# Altium schematic sheet KeyInput_MG.SchDoc
size A4
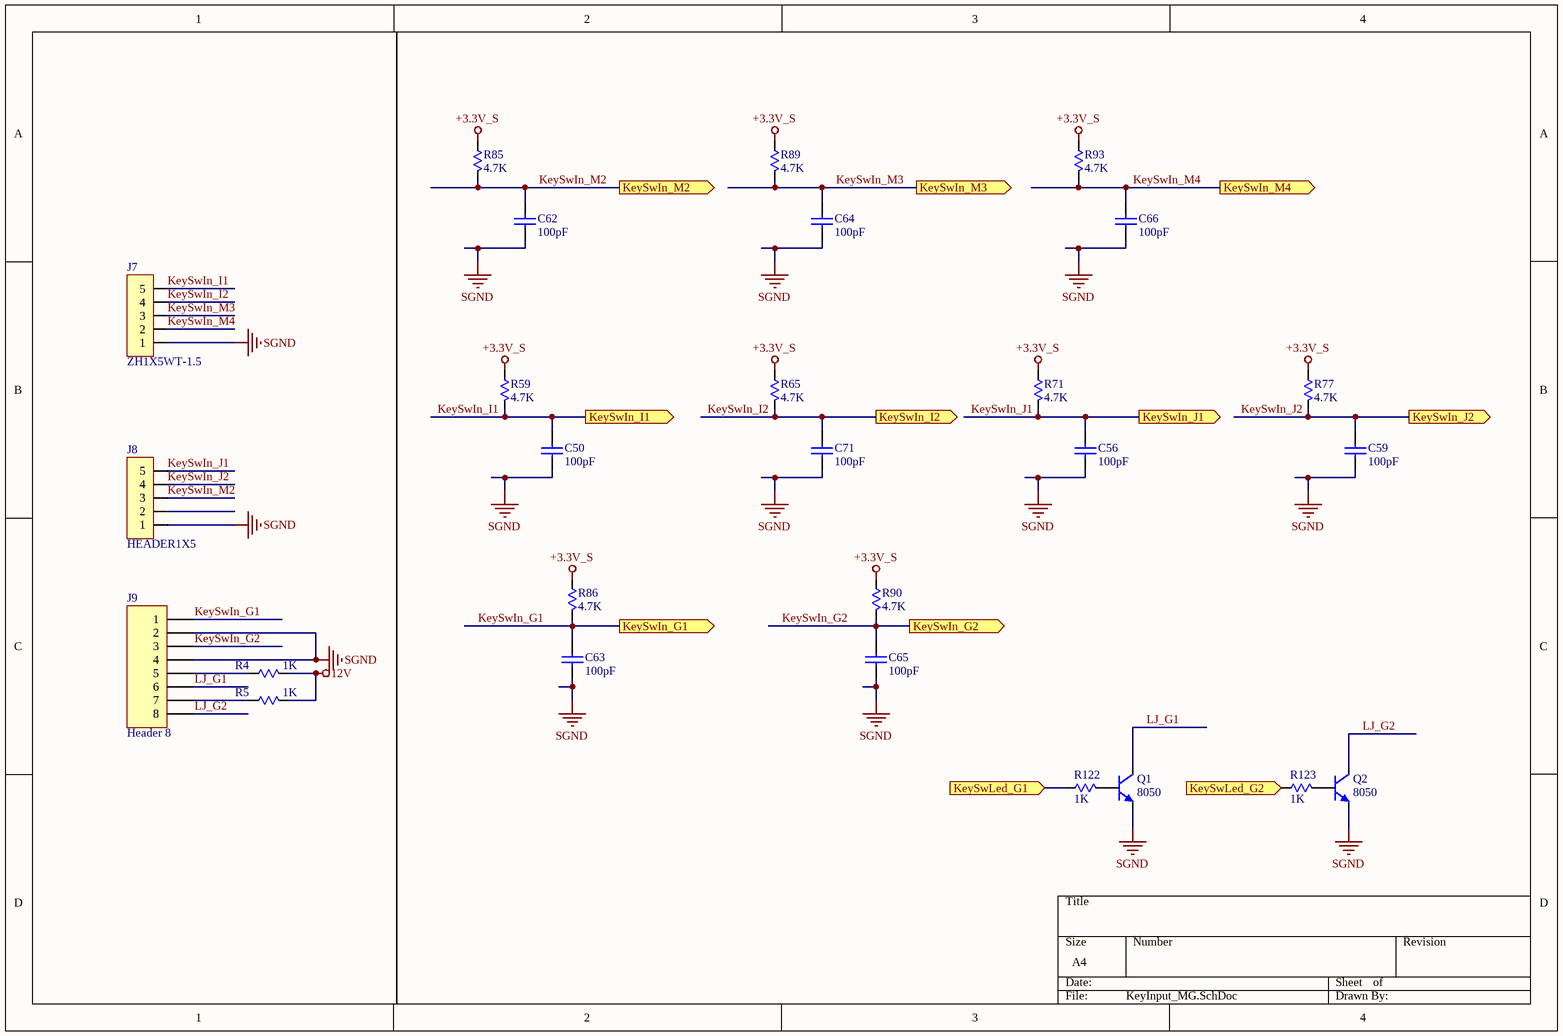
[diagram p0: KeyInput_MG.SchDoc]

## Parts
C50  100pF  [C0805]
C56  100pF  [C0805]
C59  100pF  [C0805]
C62  100pF  [C0805]
C63  100pF  [C0805]
C64  100pF  [C0805]
C65  100pF  [C0805]
C66  100pF  [C0805]
C71  100pF  [C0805]
J7  ZH1X5WT-1.5  [ZH1X5WT-1.5]
J8  HEADER1X5  [ZH1X5WT-1.5]
J9  Header 8  [ZH1X8WT-1.5]
Q1  8050  [SOT-23]
Q2  8050  [SOT-23]
R4  1K  [R0805]
R5  1K  [R0805]
R59  4.7K  [R0805]
R65  4.7K  [R0805]
R71  4.7K  [R0805]
R77  4.7K  [R0805]
R85  4.7K  [R0805]
R86  4.7K  [R0805]
R89  4.7K  [R0805]
R90  4.7K  [R0805]
R93  4.7K  [R0805]
R122  1K  [R0805]
R123  1K  [R0805]

## Ports
KeySwIn_G1 (out), KeySwIn_G2 (out), KeySwIn_I1 (out), KeySwIn_I2 (out), KeySwIn_J1 (out), KeySwIn_J2 (out), KeySwIn_M2 (out), KeySwIn_M3 (out), KeySwIn_M4 (out), KeySwLed_G1 (in), KeySwLed_G2 (in)

## Nets
12V: R4.1 R5.1
+3.3V_S: R59.2 R65.2 R71.2 R77.2 R85.2 R86.2 R89.2 R90.2 R93.2
SGND: C50.2 C56.2 C59.2 C62.2 C63.2 C64.2 C65.2 C66.2 C71.2 J7.1 J8.1 J9.2 J9.4 Q1.2(E) Q2.2(E)
KeySwIn_G1: C63.1 J9.1 R86.1 ; port KeySwIn_G1
KeySwIn_G2: C65.1 J9.3 R90.1 ; port KeySwIn_G2
KeySwIn_I1: C50.1 J7.5 R59.1 ; port KeySwIn_I1
KeySwIn_I2: C71.1 J7.4 R65.1 ; port KeySwIn_I2
KeySwIn_J1: C56.1 J8.5 R71.1 ; port KeySwIn_J1
KeySwIn_J2: C59.1 J8.4 R77.1 ; port KeySwIn_J2
KeySwIn_M2: C62.1 J8.3 R85.1 ; port KeySwIn_M2
KeySwIn_M3: C64.1 J7.3 R89.1 ; port KeySwIn_M3
KeySwIn_M4: C66.1 J7.2 R93.1 ; port KeySwIn_M4
KeySwLed_G1: R122.2 ; port KeySwLed_G1
KeySwLed_G2: R123.2 ; port KeySwLed_G2
LJ_G1: J9.6 Q1.3(C)
LJ_G2: J9.8 Q2.3(C)
NetJ9_5: J9.5 R4.2
NetJ9_7: J9.7 R5.2
NetQ1_1: Q1.1(B) R122.1
NetQ2_1: Q2.1(B) R123.1

Not connected (* = marked no-connect by the designer): J8 2

## Library data of the parts
C50 C56 C59 C62-C66 C71 = Cap: Capacitor; Value: 22pF; Published: 8-Jun-2000; Revision: July-2002: Re-released for DXP Platform.; Publisher: Altium Limited
J7 = HEADER1X5
J9 = Header 8: Header, 8-Pin; LatestRevisionDate: 17-Jul-2002; LatestRevisionNote: Re-released for DXP Platform.; Publisher: Altium Limited
Q1 Q2 = NPN: NPN General Purpose Amplifier; Published: 8-Jun-2000; LatestRevisionDate: 15-Jan-2003; LatestRevisionNote: PCB Footprint 'BCY-W3/D4.7' replaced; DatasheetDocument: 1997; PackageDocument: Sep-1998; PackageReference: TO-92A; Publisher: Altium Limited; Code_JEDEC: TO-92A; ComponentLink1Description: Manufacturer Link; ComponentLink1URL: http://www.fairchildsemi.com/; ComponentLink2Description: Datasheet; ComponentLink2URL: http://www.fairchildsemi.com/ds/2N%2F2N3904.pdf
R4 R5 R59 R65 R71 R77 R85 R86 R89 R90 R93 R122 R123 = RES: Resistor; Published: 8-Jun-2000; LatestRevisionDate: 17-Jul-2002; LatestRevisionNote: Re-released for DXP Platform.; PackageReference: AXIAL-0.3; Publisher: Altium Limited
  R4 R5 R122 R123: Value: 1K
  R59 R65 R71 R77 R85 R86 R89 R90 R93: Value: 4.7K